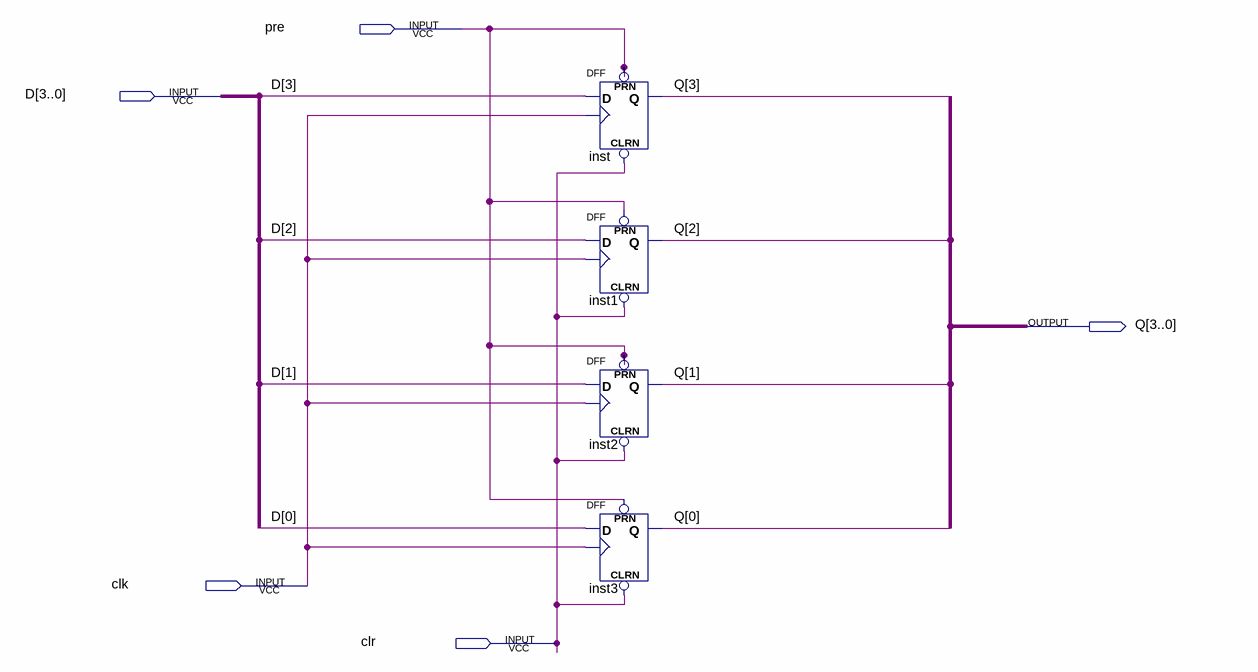
[diagram p0: schematic sheet]
// Quartus schematic fourBitReg.bdf as structural Verilog: 4 symbols, 5 pins
module fourBitReg (
  input  pre,
  input  [3:0] D,
  input  clk,
  input  clr,
  output [3:0] Q
);

  DFF inst (.CLRN(clr), .CLK(clk), .D(D[3]), .PRN(pre), .Q(Q[3]));
  DFF inst1 (.CLRN(clr), .CLK(clk), .D(D[2]), .PRN(pre), .Q(Q[2]));
  DFF inst2 (.CLRN(clr), .CLK(clk), .D(D[1]), .PRN(pre), .Q(Q[1]));
  DFF inst3 (.CLRN(clr), .CLK(clk), .D(D[0]), .PRN(pre), .Q(Q[0]));
endmodule
